# Altium schematic sheet MIPI.SchDoc
size A3; SheetNumber: 6; SheetTotal: 11
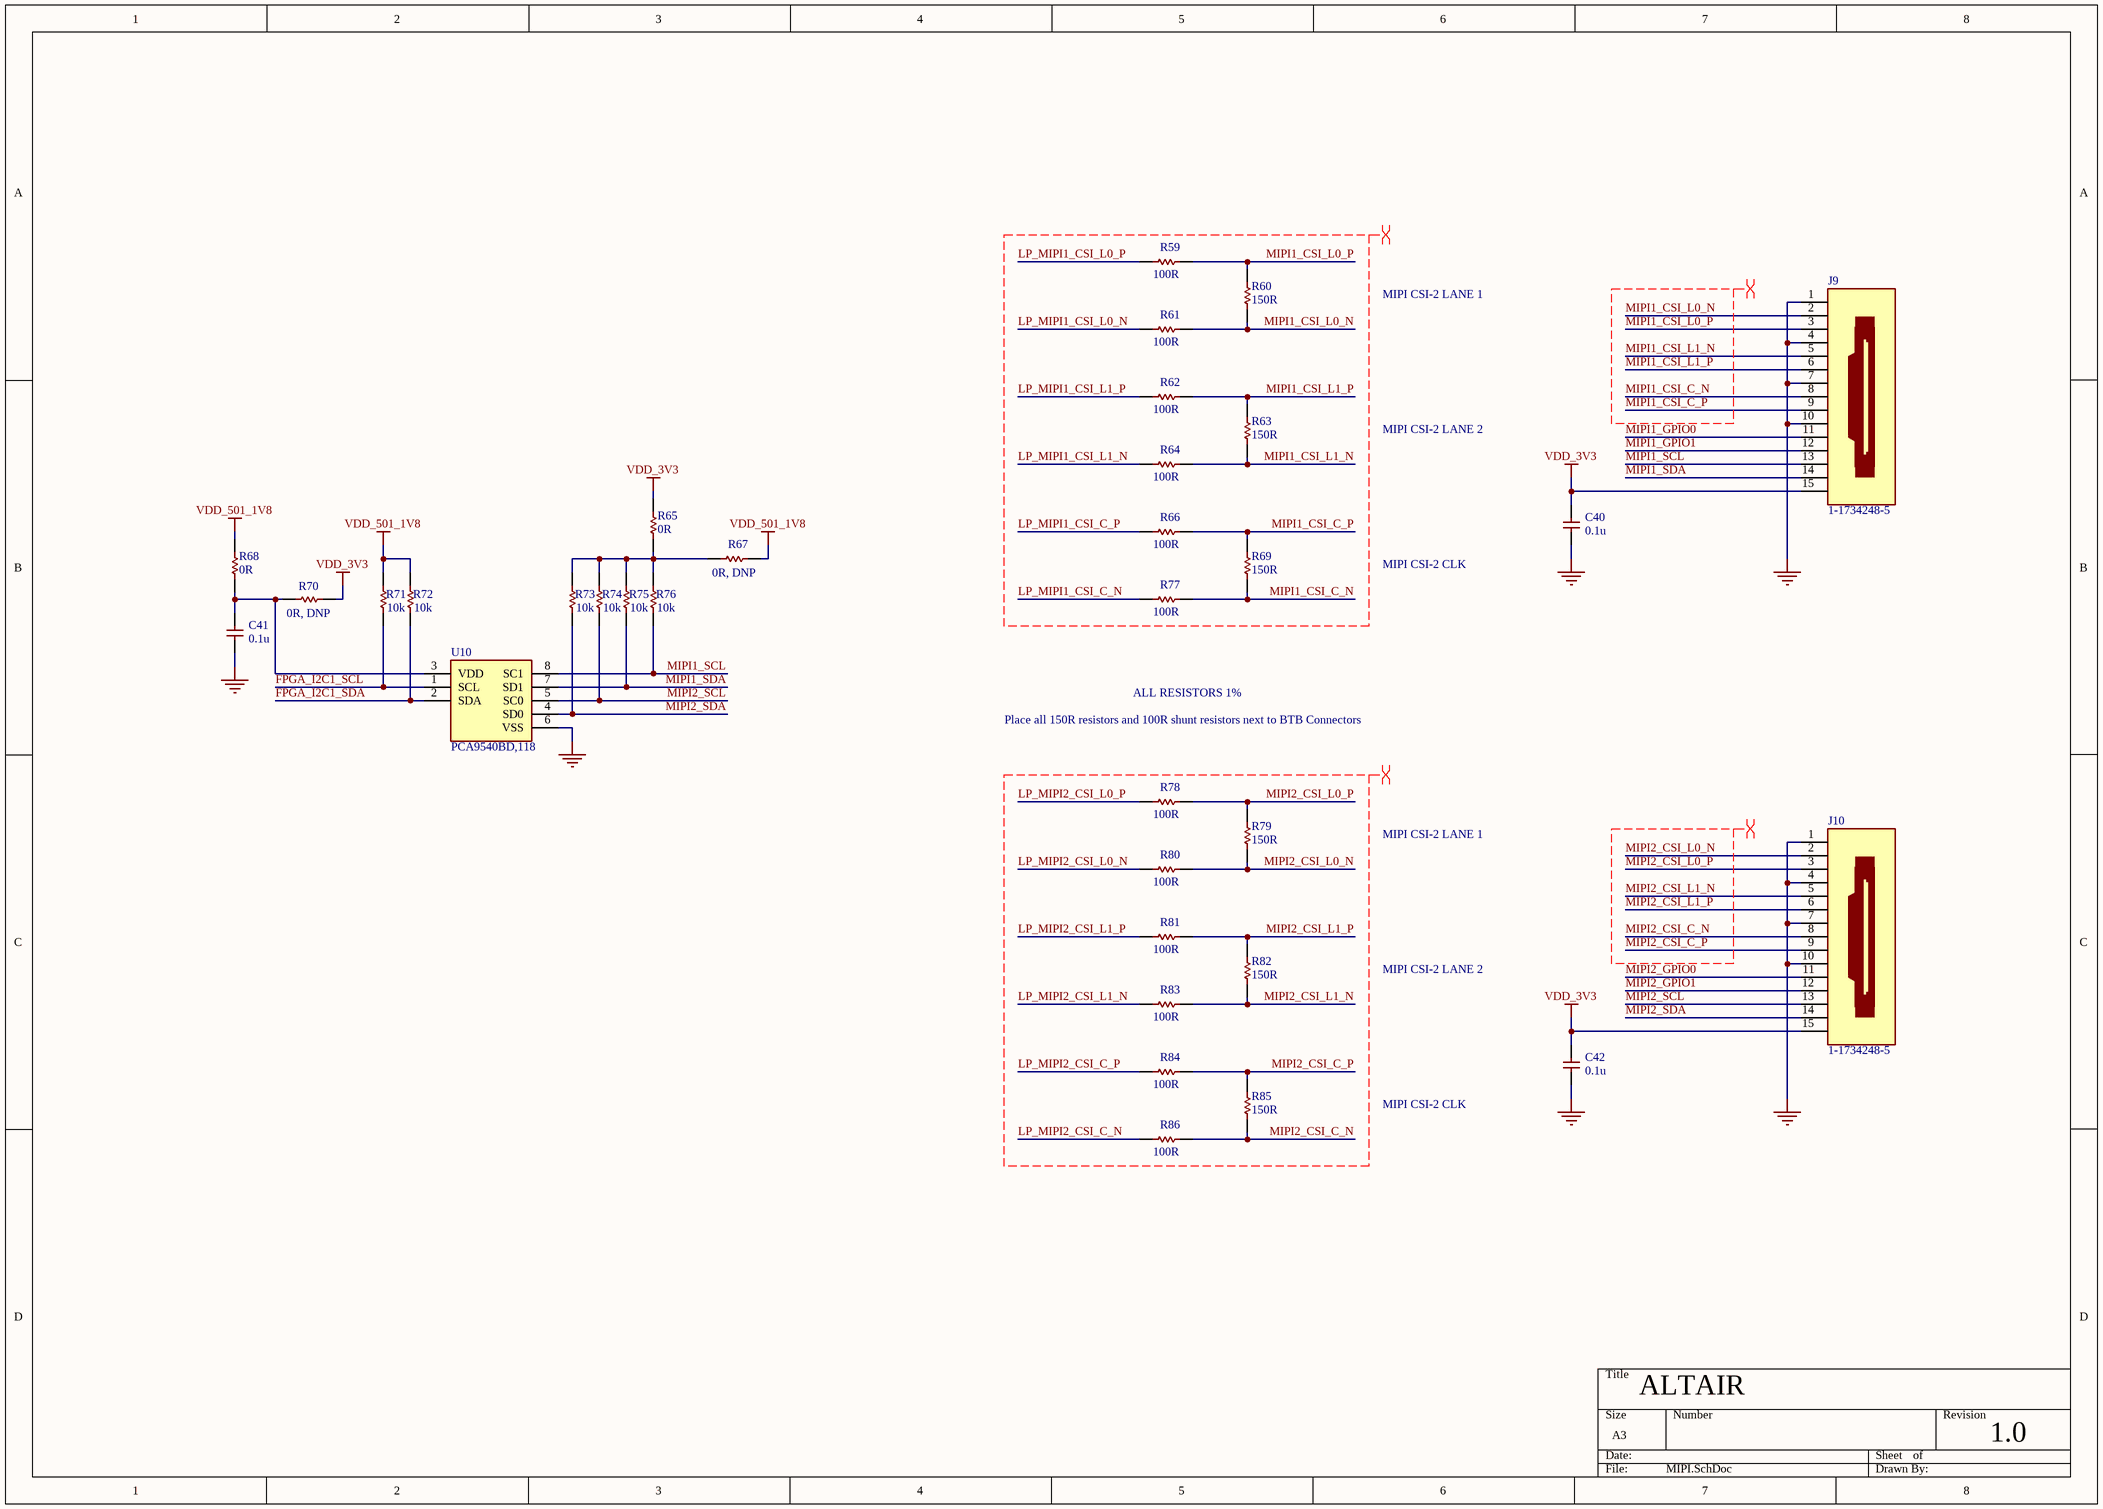
[diagram p0: MIPI.SchDoc]

## Parts
C40  0.1u  [CAP_0402]
C41  0.1u  [CAP_0402]
C42  0.1u  [CAP_0402]
J9  1-1734248-5  [FP-1-1734248-5-MFG]
J10  1-1734248-5  [FP-1-1734248-5-MFG]
R59  100R  [RES_0402]
R60  150R  [RES_0402]
R61  100R  [RES_0402]
R62  100R  [RES_0402]
R63  150R  [RES_0402]
R64  100R  [RES_0402]
R65  0R  [RES_0402]
R66  100R  [RES_0402]
R67  0R, DNP  [RES_0402]
R68  0R  [RES_0402]
R69  150R  [RES_0402]
R70  0R, DNP  [RES_0402]
R71  10k  [RES_0402]
R72  10k  [RES_0402]
R73  10k  [RES_0402]
R74  10k  [RES_0402]
R75  10k  [RES_0402]
R76  10k  [RES_0402]
R77  100R  [RES_0402]
R78  100R  [RES_0402]
R79  150R  [RES_0402]
R80  100R  [RES_0402]
R81  100R  [RES_0402]
R82  150R  [RES_0402]
R83  100R  [RES_0402]
R84  100R  [RES_0402]
R85  150R  [RES_0402]
R86  100R  [RES_0402]
U10  PCA9540BD,118  [SOIC127P600X175-8N]

## Nets
GND: C40.1 C41.1 C42.1 J9.1 J9.4 J9.7 J9.10 J10.1 J10.4 J10.7 J10.10 U10.6(VSS)
VDD_3V3: C40.2 C42.2 J9.15 J10.15 R65.2 R70.2
VDD_501_1V8: R67.2 R68.2 R71.1 R72.1
FPGA_I2C1_SCL: R71.2 U10.1(SCL)
FPGA_I2C1_SDA: R72.2 U10.2(SDA)
LP_MIPI1_CSI_C_N: R77.1
LP_MIPI1_CSI_C_P: R66.1
LP_MIPI1_CSI_L0_N: R61.1
LP_MIPI1_CSI_L0_P: R59.1
LP_MIPI1_CSI_L1_N: R64.1
LP_MIPI1_CSI_L1_P: R62.1
LP_MIPI2_CSI_C_N: R86.1
LP_MIPI2_CSI_C_P: R84.1
LP_MIPI2_CSI_L0_N: R80.1
LP_MIPI2_CSI_L0_P: R78.1
LP_MIPI2_CSI_L1_N: R83.1
LP_MIPI2_CSI_L1_P: R81.1
MIPI1_CSI_C_N: J9.8 R69.2 R77.2
MIPI1_CSI_C_P: J9.9 R66.2 R69.1
MIPI1_CSI_L0_N: J9.2 R60.2 R61.2
MIPI1_CSI_L0_P: J9.3 R59.2 R60.1
MIPI1_CSI_L1_N: J9.5 R63.2 R64.2
MIPI1_CSI_L1_P: J9.6 R62.2 R63.1
MIPI1_GPIO0: J9.11
MIPI1_GPIO1: J9.12
MIPI1_SCL: J9.13 R76.2 U10.8(SC1)
MIPI1_SDA: J9.14 R75.2 U10.7(SD1)
MIPI2_CSI_C_N: J10.8 R85.2 R86.2
MIPI2_CSI_C_P: J10.9 R84.2 R85.1
MIPI2_CSI_L0_N: J10.2 R79.2 R80.2
MIPI2_CSI_L0_P: J10.3 R78.2 R79.1
MIPI2_CSI_L1_N: J10.5 R82.2 R83.2
MIPI2_CSI_L1_P: J10.6 R81.2 R82.1
MIPI2_GPIO0: J10.11
MIPI2_GPIO1: J10.12
MIPI2_SCL: J10.13 R74.2 U10.5(SC0)
MIPI2_SDA: J10.14 R73.2 U10.4(SD0)
NetC41_2: C41.2 R68.1 R70.1 U10.3(VDD)
NetR65_1: R65.1 R67.1 R73.1 R74.1 R75.1 R76.1

## Layout directives
differential pair: LP_MIPI1_CSI_C_N, LP_MIPI1_CSI_C_P, LP_MIPI1_CSI_L0_N, LP_MIPI1_CSI_L0_P, LP_MIPI1_CSI_L1_N, LP_MIPI1_CSI_L1_P, LP_MIPI2_CSI_C_N, LP_MIPI2_CSI_C_P, LP_MIPI2_CSI_L0_N, LP_MIPI2_CSI_L0_P, LP_MIPI2_CSI_L1_N, LP_MIPI2_CSI_L1_P, MIPI1_CSI_C_N, MIPI1_CSI_C_P, MIPI1_CSI_L0_N, MIPI1_CSI_L0_P, MIPI1_CSI_L1_N, MIPI1_CSI_L1_P, MIPI2_CSI_C_N, MIPI2_CSI_C_P, MIPI2_CSI_L0_N, MIPI2_CSI_L0_P, MIPI2_CSI_L1_N, MIPI2_CSI_L1_P

## Notes on the sheet
- MIPI CSI-2 LANE 1
- MIPI CSI-2 LANE 2
- MIPI CSI-2 CLK
- Place all 150R resistors and 100R shunt resistors next to BTB Connectors
- ALL RESISTORS 1%
- ALTAIR
- 1.0

## Library data of the parts
C40-C42 = CAP_0402: Capacitor SMD 0402; Part No: CL05B104KO5NNNC; Note/Misc: 16V, 0402; LCSC: *; JLCPCB Part #: C338112; Footprint JLCPCB: 0402
J9 J10 = 1-1734248-5: FPC CONNECTOR VERT 15 PINS 1.00MM SMD; LCSC: *; Note/Misc: *; Part No: 1-1734248-5; JLCPCB Part #: C2922285; Footprint JLCPCB: SMD,P=1mm
R59 R61 R62 R64 R66 R77 R78 R80 R81 R83 R84 R86 = RES_0402: Resistor SMD 0402; Part No: RC0402FR-07100RL; Note/Misc: 1%; LCSC: *; JLCPCB Part #: C106232; Footprint JLCPCB: 0402
R60 R63 R69 R79 R82 R85 = RES_0402: Resistor SMD 0402; Part No: RC0402FR-07150RL; Note/Misc: 1%; LCSC: *; JLCPCB Part #: C138054; Footprint JLCPCB: 0402
R65 R67 R68 R70 = RES_0402: Resistor SMD 0402; Part No: RC0402JR-070RL; LCSC: *; JLCPCB Part #: C60485; Footprint JLCPCB: 0402
  R67 R70: Note/Misc: DNP
R71-R76 = RES_0402: Resistor SMD 0402; Part No: RC0402JR-0710KL; LCSC: *; JLCPCB Part #: C60489; Footprint JLCPCB: 0402
U10 = PCA9540BD,118: Integrated Circuit; LCSC: *; Note/Misc: *; Part No: PCA9540BD,118; JLCPCB Part #: C2674107; Footprint JLCPCB: SO-8